# Altium schematic sheet SuperBot_Sensors.SchDoc
size A4
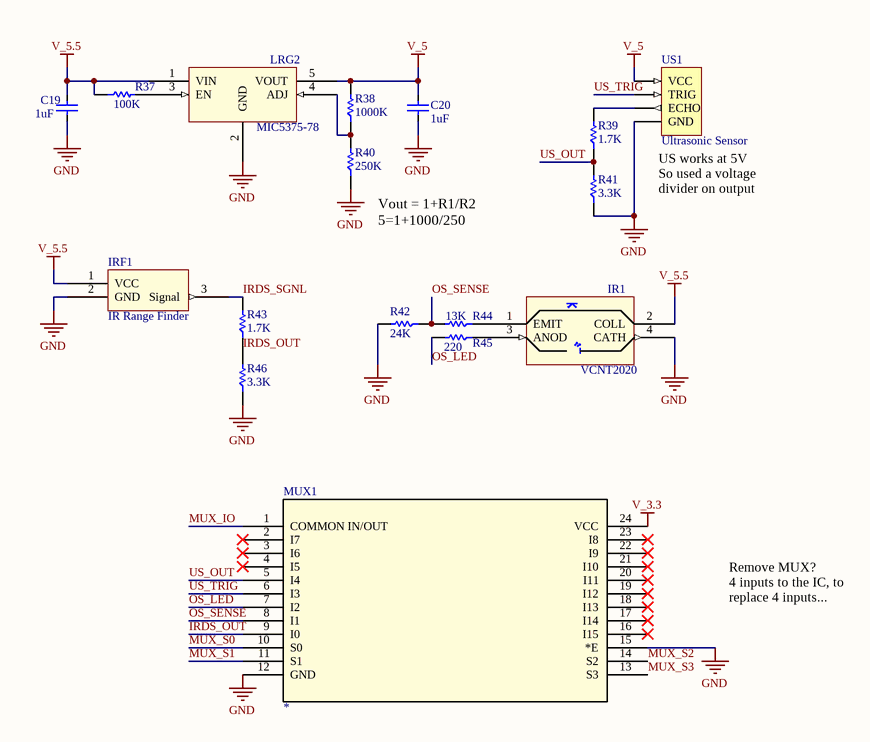
[diagram p0: SuperBot_Sensors.SchDoc]

## Parts
C19  1uF  [CAP0603R]
C20  1uF  [CAP0603R]
IR1  VCNT2020  [VCNT2020]
IRF1  IR Range Finder  [H3]
LRG2  MIC5375-78  [TSOP5_MIC537X]
MUX1  *  [DB24-M]
R37  100K  [RES0603R]
R38  1000K  [RES0603R]
R39  1.7K  [RES0603R]
R40  250K  [RES0603R]
R41  3.3K  [RES0603R]
R42  24K  [RES0603R]
R43  1.7K  [RES0603R]
R44  13K  [RES0603R]
R45  220  [RES0603R]
R46  3.3K  [RES0603R]
US1  Ultrasonic Sensor  [HDR1X4]

## Nets
GND: C19.2 C20.1 IR1.4(CATH) IRF1.2(GND) LRG2.2(GND) MUX1.12(GND) MUX1.15(*E) R40.1 R41.1 R42.2 R46.1 US1.4(GND)
V_3.3: MUX1.24(VCC)
V_5: C20.2 LRG2.5(VOUT) R38.2 US1.1(VCC)
V_5.5: C19.1 IR1.2(COLL) IRF1.1(VCC) LRG2.1(VIN) R37.1
IRDS_OUT: MUX1.9(I0) R43.1 R46.2
IRDS_SGNL: IRF1.3(Signal) R43.2
MUX_IO: MUX1.1(COMMON_IN/OUT)
MUX_S0: MUX1.10(S0)
MUX_S1: MUX1.11(S1)
MUX_S2: MUX1.14(S2)
MUX_S3: MUX1.13(S3)
OS_LED: MUX1.7(I2) R45.2
OS_SENSE: MUX1.8(I1) R42.1 R44.2
US_OUT: MUX1.5(I4) R39.1 R41.2
US_TRIG: MUX1.6(I3) US1.2(TRIG)
NetIR1_1: IR1.1(EMIT) R44.1
NetIR1_3: IR1.3(ANOD) R45.1
NetLRG2_3: LRG2.3(EN) R37.2
NetLRG2_4: LRG2.4(ADJ) R38.1 R40.2
NetR39_2: R39.2 US1.3(ECHO)

Not connected (* = marked no-connect by the designer): MUX1 2(I7)* 3(I6)* 4(I5)* 16(I15)* 17(I14)* 18(I13)* 19(I12)* 20(I11)* 21(I10)* 22(I9)* 23(I8)*

## Notes on the sheet
- (near US1) US works at 5V
  So used a voltage divider on output
- (near R40) Vout = 1+R1/R2
  5=1+1000/250
- Remove MUX?
  4 inputs to the IC, to replace 4 inputs...

## Library data of the parts
C19 C20 = C: Capacitor; Manufacturer: Microchip Technology; Manufacturer Part Num: MIC5378YC5-TR; Class I: Passive; Revision: July-2002: Re-released for DXP Platform.; Supplier 1: Digikey; Supplier Part Number 1: *; Supplier Part Number 1: 1611-MIC5378YC5-CT-ND; Value: 1uF
IR1 = VCNT2020: Reflective Optical Sensor with Transistor Output; Manufacturer: Vishay Semiconductor; Class I: Sensor; Manufacturer Part Num: VCNT2020; Supplier 1: Digikey; Supplier Part Number 1: VCNT2020CT-ND
IRF1 = IR-Range-Finder: Sharp IR GP2Y0A21YK0F; Supplier 1: Digikey
LRG2 = MIC5378YC5: Linear Voltage Regulator IC Positive Adjustable 1 Output 1.5 V ~ 4.5 V 150mA SC-70-5; Manufacturer: Microchip Technology; Manufacturer Part Num: MIC5378YC5-TR; Supplier 1: Digikey; Supplier Part Number 1: 1611-MIC5378YC5-CT-ND
MUX1 = CD74HC4067SM96: Imported; Vendor: Texas Instruments; Built_By: EMA_UL_Team; C: Copyright (C) 2015 Accelerated Designs. All rights reserved; Manufacturer_Part_Number: CD74HC4067SM96; Value: Value; Type: Type; RefDes: RefDes
R37-R46 = R: Resistor; Supplier 1: Digikey; Supplier Part Number 1: *
  R37: Value: 100K
  R38: Value: 1000K
  R39 R43: Value: 1.7K
  R40: Value: 250K
  R41 R46: Value: 3.3K
  R42: Value: 24K
  R44: Value: 13K
  R45: Value: 220
US1 = Header 4: Header, 4-Pin; LatestRevisionDate: 17-Jul-2002; LatestRevisionNote: Re-released for DXP Platform.; Publisher: Altium Limited